# EAGLE design MT9V034 (EAGLE 9.1.2)
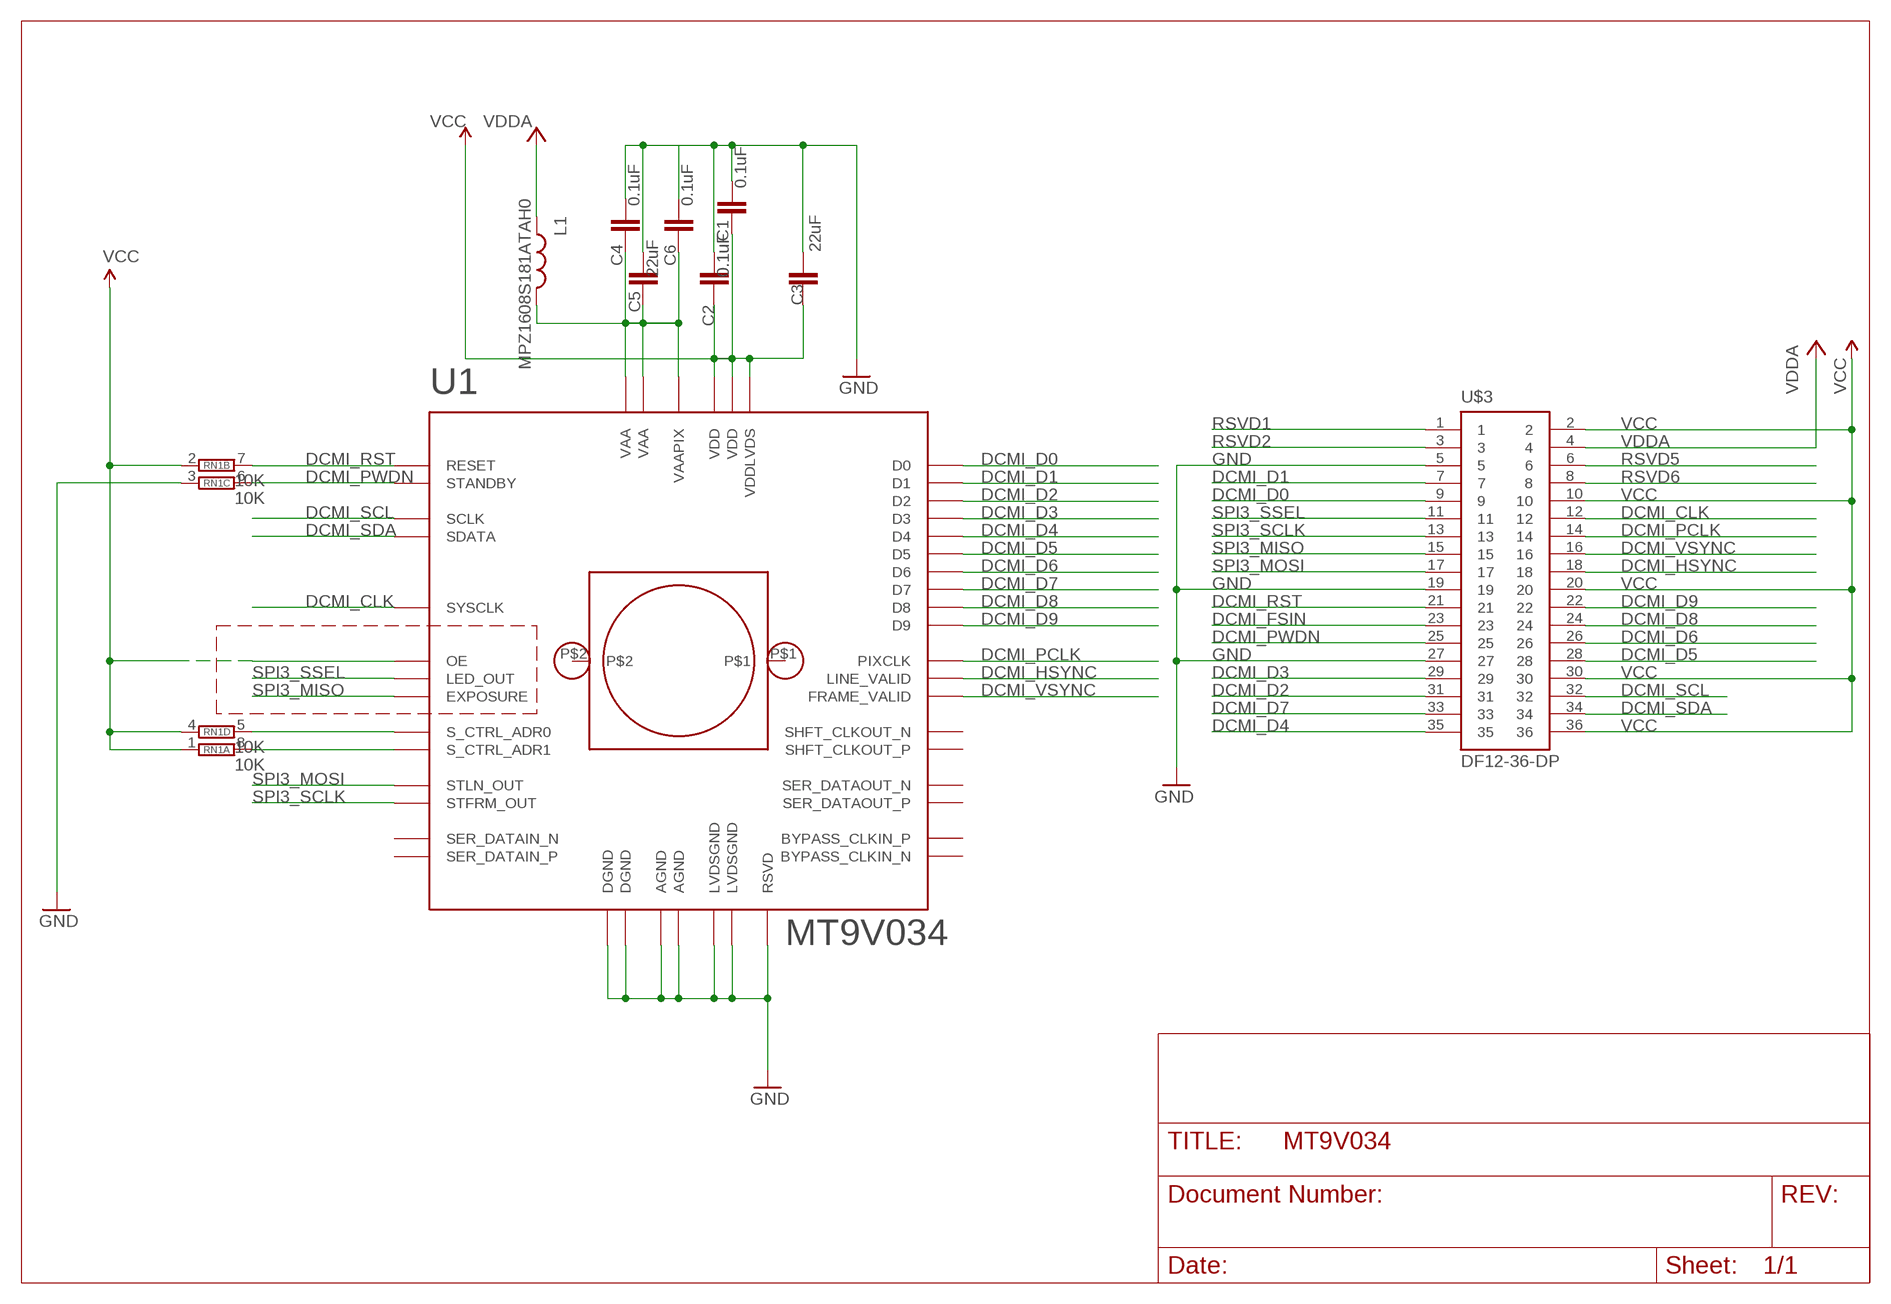
[diagram p0: schematic, sheet 1]

## Parts
C1  0.1uF  CAP0402-CAP  [0402-CAP]
C2  0.1uF  CAP0402-CAP  [0402-CAP]
C3  22uF  CAP0805  [0805]
C4  0.1uF  CAP0402-CAP  [0402-CAP]
C5  22uF  CAP0805  [0805]
C6  0.1uF  CAP0402-CAP  [0402-CAP]
L1  MPZ1608S181ATAH0  INDUCTOR0603  [0603]
LM1  LENSMOUNT20MM  [LENSMOUNT-20MM]
RN1  10K  4R-NEXBV8V  [EXBV8V]
U1  MT9V034  MT9V032  [CLCC-48]
U$3  DF12-36-DP  [DF12-36-DP]

## Nets
DCMI_CLK: U1.P$47(SYSCLK) U$3.12
DCMI_D0: U1.P$45(D0) U$3.9
DCMI_D1: U1.P$44(D1) U$3.7
DCMI_D2: U1.P$43(D2) U$3.31
DCMI_D3: U1.P$42(D3) U$3.29
DCMI_D4: U1.P$41(D4) U$3.35
DCMI_D5: U1.P$15(D5) U$3.28
DCMI_D6: U1.P$16(D6) U$3.26
DCMI_D7: U1.P$17(D7) U$3.33
DCMI_D8: U1.P$18(D8) U$3.24
DCMI_D9: U1.P$19(D9) U$3.22
DCMI_FSIN: U$3.23
DCMI_HSYNC: U1.P$20(LINE_VALID) U$3.18
DCMI_PCLK: U1.P$46(PIXCLK) U$3.14
DCMI_PWDN: RN1.6 U1.P$33(STANDBY) U$3.25
DCMI_RST: RN1.7 U1.P$32(RESET) U$3.21
DCMI_SCL: U1.P$25(SCLK) U$3.32
DCMI_SDA: U1.P$24(SDATA) U$3.34
DCMI_VSYNC: U1.P$21(FRAME_VALID) U$3.16
GND: C1.2 C2.2 C3.1 C4.2 C5.1 C6.2 RN1.3 U1.P$7(LVDSGND) U1.P$12(LVDSGND) U1.P$13(DGND) U1.P$29(RSVD) U1.P$34(AGND) U1.P$38(AGND) U1.P$48(DGND) U$3.5 U$3.19 U$3.27
N$19: RN1.5 U1.P$30(S_CTRL_ADR0)
N$20: RN1.8 U1.P$31(S_CTRL_ADR1)
RSVD1: U$3.1
RSVD2: U$3.3
RSVD5: U$3.6
RSVD6: U$3.8
SPI3_MISO: U1.P$23(EXPOSURE) U$3.15
SPI3_MOSI: U1.P$22(STLN_OUT) U$3.17
SPI3_SCLK: U1.P$26(STFRM_OUT) U$3.13
SPI3_SSEL: U1.P$27(LED_OUT) U$3.11
VAA: C4.1 C5.2 C6.1 L1.2 U1.P$35(VAA) U1.P$39(VAA) U1.P$40(VAAPIX)
VCC: C1.1 C2.1 C3.2 RN1.1 RN1.2 RN1.4 U1.P$1(VDD) U1.P$6(VDDLVDS) U1.P$14(VDD) U1.P$28(OE) U$3.2 U$3.10 U$3.20 U$3.30 U$3.36
VDDA: L1.1 U$3.4
Unconnected: LM1.P$1 LM1.P$2 U1.P$2(SHFT_CLKOUT_N) U1.P$3(SHFT_CLKOUT_P) U1.P$4(SER_DATAOUT_P) U1.P$5(SER_DATAOUT_N) U1.P$8(BYPASS_CLKIN_N) U1.P$9(BYPASS_CLKIN_P) U1.P$10(SER_DATAIN_N) U1.P$11(SER_DATAIN_P)

## Library data of the parts
C1-C6 = sfe:CAP: Capacitor Standard 0603 ceramic capacitor, and 0.1" leaded capacitor.
L1 = sfe:INDUCTOR: Inductors Basic Inductor/Choke - 0603 and 1206. Footprints are not proven and vary greatly between part numbers.
LM1 = omnivision:LENSMOUNT
RN1 = resistor-dil:4R-N: Array Chip Resistor Source: RS Component / Phycomp; OC_FARNELL: unknown; OC_NEWARK: unknown
U1 = MT9V032:MT9V032
U$3 = DF12:DF12-36-DP

## Board
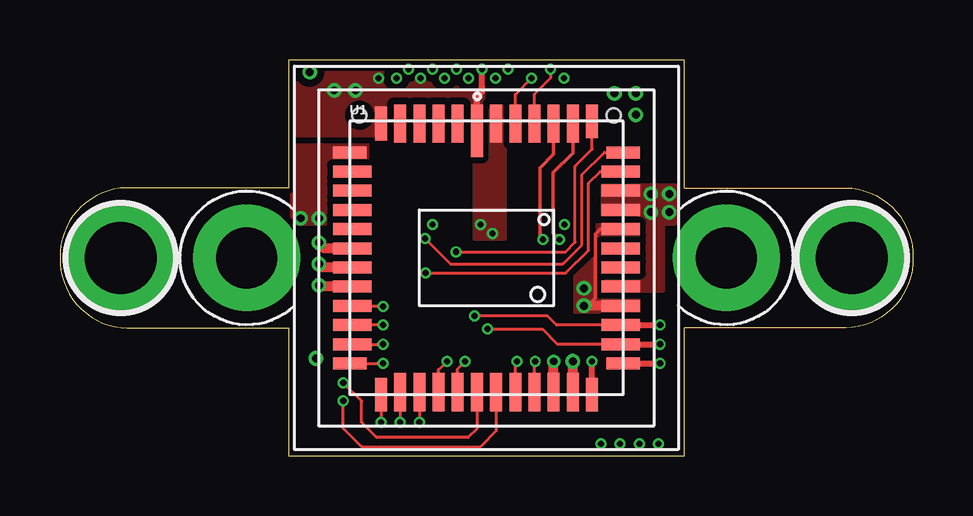
[diagram p1: board, top side]
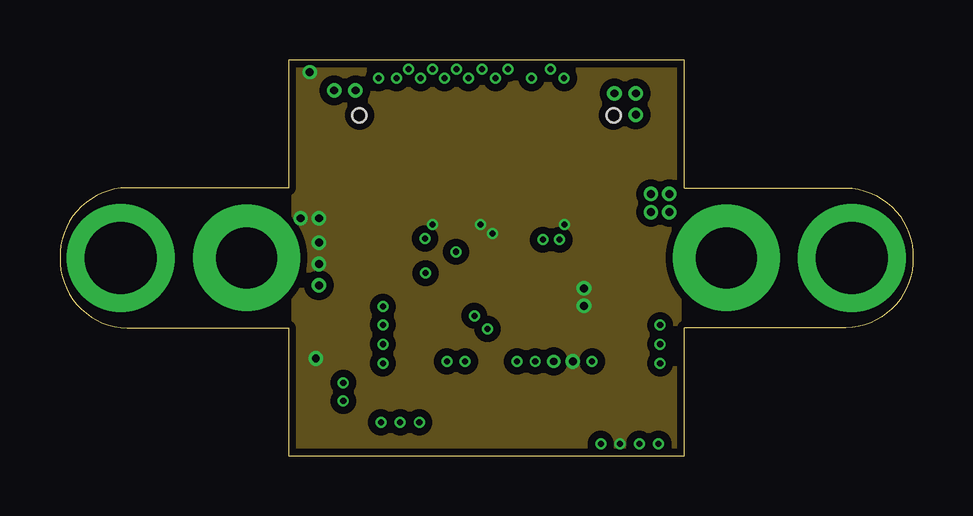
[diagram p2: board, inner layer GND]
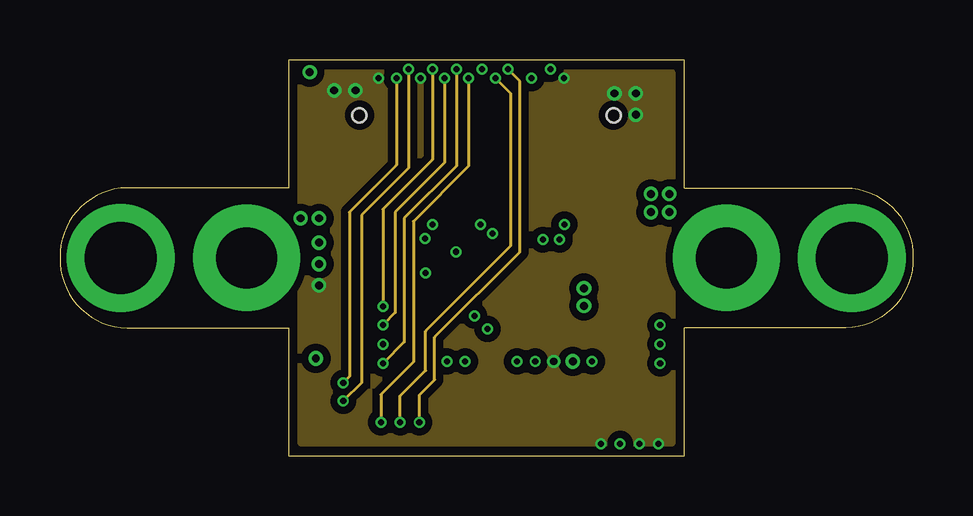
[diagram p3: board, inner layer VCC]
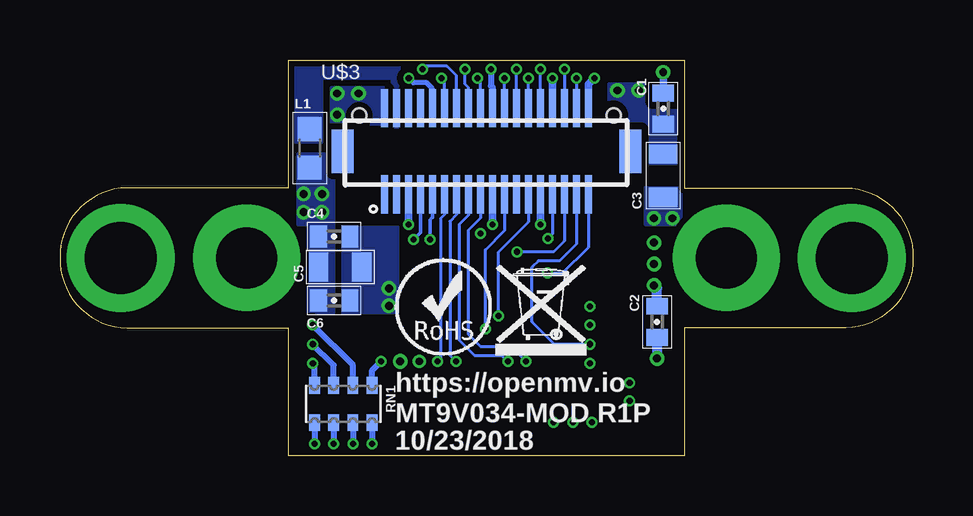
[diagram p4: board, bottom side, seen from below]

Size 35.56 x 16.51 mm. Coordinates in mm from the lower left corner, seen from the top.
Outline: 9.53,16.51 9.53,11.18 2.79,11.18 arc90 0,8.26 arc90 2.79,5.33 9.53,5.33 9.53,0 26.04,0 26.04,5.33 32.77,5.33 arc90 35.56,8.26 arc90 32.77,11.18 26.04,11.18 26.04,16.51 9.53,16.51
Copper layers (1*2+15*16): Top 0.035mm / dielectric 1.5mm / GND 0.035mm / dielectric 0.15mm / VCC 0.035mm / dielectric 0.2mm / Bottom 0.035mm
Design rules "openmv3": minimum track width 5mil, minimum drill 10mil, track to track 6mil, track to pad 6mil, pad to pad 6mil, via to via 6mil, smd to smd 6mil, copper to edge 5mil, drill to drill 10mil, minimum pad ring 10mil, minimum via ring 4mil, stop-mask expansion 2mil, vias tented up to drill 30mil, thermal gap 10mil

### Footprints (pad centres in the part's own frame; a part is rotated, then mirrored left to right if it is on the bottom)
0402-CAP = smd 0.7 x 0.9: 1 -0.65,0; 2 0.65,0
0805 = smd 0.8 x 1.2: 1 -0.9,0; 2 0.9,0
0603 = smd 1 x 1: 1 -0.8,0; 2 0.8,0
LENSMOUNT-20MM = drill 2.54 pad 4.445: P$1 -10,0; P$2 10,0
EXBV8V = smd 0.45 x 0.7: 1 -1.2,-0.775; 2 -0.4,-0.775; 3 0.4,-0.775; 4 1.2,-0.775; 5 1.2,0.775; 6 0.4,0.775; 7 -0.4,0.775; 8 -1.2,0.775
CLCC-48 = smd 0.5 x 2.2: P$1 -0.4,5.3 | smd 0.5 x 1.6: P$2 -1.2,5.6; P$3 -2,5.6; P$4 -2.8,5.6; P$5 -3.6,5.6; P$20 -3.6,-5.6; P$21 -2.8,-5.6; P$22 -2,-5.6; P$23 -1.2,-5.6; P$24 -0.4,-5.6; P$25 0.4,-5.6; P$26 1.2,-5.6; P$27 2,-5.6; P$28 2.8,-5.6; P$29 3.6,-5.6; P$44 3.6,5.6; P$45 2.8,5.6; P$46 2,5.6; P$47 1.2,5.6; P$48 0.4,5.6 | smd 0.5 x 1.4: P$6 -4.4,5.6; P$19 -4.4,-5.7; P$30 4.4,-5.7; P$43 4.4,5.7 | smd 1.4 x 0.5: P$7 -5.7,4.4; P$18 -5.7,-4.4; P$31 5.7,-4.4; P$42 5.7,4.4 | smd 1.6 x 0.5: P$8 -5.6,3.6; P$9 -5.6,2.8; P$10 -5.6,2; P$11 -5.6,1.2; P$12 -5.6,0.4; P$13 -5.6,-0.4; P$14 -5.6,-1.2; P$15 -5.6,-2; P$16 -5.6,-2.8; P$17 -5.6,-3.6; P$32 5.6,-3.6; P$33 5.6,-2.8; P$34 5.6,-2; P$35 5.6,-1.2; P$36 5.6,-0.4; P$37 5.6,0.4; P$38 5.6,1.2; P$39 5.6,2; P$40 5.6,2.8; P$41 5.6,3.6
DF12-36-DP = smd 0.3 x 1.6: 1 -4.25,-1.8; 2 -4.25,1.8; 3 -3.75,-1.8; 4 -3.75,1.8; 5 -3.25,-1.8; 6 -3.25,1.8; 7 -2.75,-1.8; 8 -2.75,1.8; 9 -2.25,-1.8; 10 -2.25,1.8; 11 -1.75,-1.8; 12 -1.75,1.8; 13 -1.25,-1.8; 14 -1.25,1.8; 15 -0.75,-1.8; 16 -0.75,1.8; 17 -0.25,-1.8; 18 -0.25,1.8; 19 0.25,-1.8; 20 0.25,1.8; 21 0.75,-1.8; 22 0.75,1.8; 23 1.25,-1.8; 24 1.25,1.8; 25 1.75,-1.8; 26 1.75,1.8; 27 2.25,-1.8; 28 2.25,1.8; 29 2.75,-1.8; 30 2.75,1.8; 31 3.25,-1.8; 32 3.25,1.8; 33 3.75,-1.8; 34 3.75,1.8; 35 4.25,-1.8; 36 4.25,1.8 | smd 0.9 x 1.8: F1 -6,0; F2 6,0 | hole 0.6: -5.3,1.5; 5.3,1.5

### Placement (x,y rotation side)
C1  10.41,14.48 90 bottom
C2  10.67,5.59 270 bottom
C3  10.41,11.68 90 bottom
C4  24.13,9.14 0 bottom
C5  23.88,7.87 180 bottom
C6  24.13,6.48 0 bottom
L1  25.15,12.83 270 bottom
LM1  17.78,8.26 0 top
RN1  23.75,2.16 0 bottom
U1  17.78,8.26 0 top
U$1  [WEEE]  17.4,4.19 0 bottom
U$2  [ROHS]  21.59,4.19 0 bottom
U$3  17.78,12.7 0 bottom

### Tracks (layer width: path | path; a pad name or v marks a point on that pad's centre or on a via)
DCMI_CLK  (via drill 0.25)
  Top 0.127: U1.P$47 18.98,15.07 v19.66,15.75
  Bottom 0.127: U$3.12 19.53,15.62 v19.66,15.75
DCMI_D0  (via drill 0.25)
  Top 0.152: U1.P$45 20.58,12.58 20,12 20,9.14 v20.13,9.02
  Bottom 0.152: U$3.9 20.03,9.94 20.07,9.91 20.13,9.84 v20.13,9.02
DCMI_D1  (via drill 0.25)
  Top 0.152: v20.83,9.02 20.56,9.28 20.56,11.81 21.38,12.63 U1.P$44
  Bottom 0.152: 20.57,10.86 U$3.7 20.53,9.31 20.57,9.27 | 20.57,9.27 | 20.57,9.27 v20.83,9.02
DCMI_D2  (via drill 0.25)
  Top 0.127: 22.18,12.78 22.18,12.83 | 22.18,12.83 U1.P$43 | 22.18,12.78 22.18,12.83 | 22.18,12.78 21.48,12.08 21.48,8.91 21.08,8.51 v16.51,8.51
  Bottom 0.127: U$3.31 14.53,8.96 14.99,8.51 v16.51,8.51
DCMI_D3  (via drill 0.25)
  Top 0.127: U1.P$42 22.69,12.65 21.75,11.72 21.75,9.02 21.75,8.79 20.96,8 16.28,8 v15.22,9.06
  Bottom 0.127: U$3.29 15.03,9.25 v15.22,9.06
DCMI_D4  (via drill 0.25)
  Top 0.127: U1.P$41 22.52,11.86 22.03,11.37 22.03,8.57 21.08,7.62 v15.24,7.62
  Bottom 0.127: U$3.35 13.53,8.7 14.61,7.62 v15.24,7.62
DCMI_D5  (via drill 0.25)
  Top 0.127: v13.46,6.22 12.21,6.22 U1.P$15
  VCC 0.127: v15.53,16.13 15.53,12.36 13.46,10.29 v13.46,6.22
  Bottom 0.127: U$3.28 v15.53,16.13
DCMI_D6  (via drill 0.25)
  Top 0.127: v13.46,5.46 U1.P$16
  VCC 0.127: v16.03,15.75 16.03,12.22 13.97,10.16 13.97,5.97 v13.46,5.46
  Bottom 0.127: U$3.26 v16.03,15.75
DCMI_D7  (via drill 0.25)
  Top 0.127: U1.P$17 v13.46,4.66
  Bottom 0.127: U$3.33 14.03,8.83 14.73,8.13 15.62,8.13 15.88,7.87 15.88,5.59 14.94,4.66 v13.46,4.66
DCMI_D8  (via drill 0.25)
  Top 0.127: U1.P$18 v13.46,3.85
  VCC 0.127: v16.53,16.13 16.53,12.09 14.35,9.91 14.35,4.74 v13.46,3.85
  Bottom 0.127: U$3.24 v16.53,16.13
DCMI_D9  (via drill 0.25)
  Top 0.127: U1.P$19 v13.38,1.4
  VCC 0.127: v17.03,15.75 17.03,12.08 14.73,9.78 14.73,3.91 U1.P$19 v13.38,1.4
  Bottom 0.127: U$3.22 v17.03,15.75
DCMI_HSYNC  (via drill 0.25)
  Top 0.127: U1.P$20 v14.18,1.4
  VCC 0.127: v14.18,1.4 14.18,2.5 15.24,3.56 15.24,5.21 18.8,8.76 18.8,15.11 v18.16,15.75
  Bottom 0.127: U$3.18 18.03,15.62 v18.16,15.75
DCMI_PCLK  (via drill 0.25)
  Top 0.127: U1.P$46 19.78,15.08 20.45,15.75 v20.45,16.13
  Bottom 0.127: U$3.14 19.03,15.86 19.43,16.26 20.32,16.26 v20.45,16.13
DCMI_PWDN  (via drill 0.25)
  Top 0.127: U1.P$33 20.71,5.46 20.32,5.84 v17.28,5.84
  Top 0.254: U1.P$33 v25.02,5.46
  Bottom 0.127: U$3.25 16.03,9.75 17.28,8.5 v17.28,5.84
  Bottom 0.254: RN1.6 23.35,3.79 v25.02,5.46
DCMI_RST  (via drill 0.25)
  Top 0.127: v17.82,5.29 20.11,5.29 20.75,4.66 U1.P$32
  Top 0.254: U1.P$32 v25.02,4.66
  Bottom 0.127: U$3.21 17.03,9.39 17.82,8.59 v17.82,5.29
  Bottom 0.254: RN1.7 24.15,3.79 v25.02,4.66
DCMI_SCL  (via drill 0.25)
  Top 0.127: U1.P$25 18.18,1.03 17.53,0.38 12.57,0.38 11.81,1.14 v11.81,2.29
  VCC 0.127: v14.53,16.13 14.53,11.99 12.57,10.03 12.57,3.05 v11.81,2.29
  Bottom 0.127: v14.53,16.13 U$3.32
DCMI_SDA  (via drill 0.25)
  Top 0.127: U1.P$24 17.38,1.12 17.02,0.76 13.21,0.76 12.57,1.4 12.57,2.29 v11.81,3.05
  VCC 0.127: v14.03,15.75 14.03,12.12 12.07,10.16 12.07,3.3 v11.81,3.05
  Bottom 0.127: v14.03,15.75 U$3.34
DCMI_VSYNC  (via drill 0.25)
  Top 0.127: U1.P$21 v14.98,1.4
  VCC 0.127: v14.98,1.4 14.98,2.53 15.62,3.17 15.62,4.95 19.18,8.51 19.18,15.62 v18.67,16.13
  Bottom 0.127: U$3.16 18.53,15.36 18.67,15.49 v18.67,16.13
GND  (via drill 0.25, 0.33, 0.33 pad 0.61)
  Top 0.152: U1.P$38 22.54,9.46 22.33,9.24 22.33,6.58 22.23,6.48
  Top 0.406: U1.P$12 11.03,8.65 v10.79,8.89 | U1.P$13 10.94,7.86 v10.79,8 | U1.P$29 v21.38,3.94 | U1.P$34 v21.84,6.25
  Bottom 0.254: RN1.3 v23.35,0.51
  Bottom 0.305: C1.2 v10.41,16 | U$3.27 v15.53,9.65 | U$3.5 v21.03,9.65 | U$3.19 v17.53,9.65
  Bottom 0.406: C2.2 v10.67,4.06
  other vias: 10.79,9.91 10.03,9.91 21.84,6.99 18.03,9.27
  pour Top (isolate 0.254, rank 5, no thermals): 9.65,13.08 12.83,13.08 12.83,9.65 9.65,9.65
  pour GND (isolate 0.305): 9.78,0.25 9.78,16.26 25.78,16.26 25.78,0.25
  pour Bottom (isolate 0.254, rank 5, no thermals): 21.46,9.53 23.88,9.53 23.88,5.97 21.46,5.97
  pour Top (isolate 0.254, rank 5, no thermals): 21.46,9.65 24.13,9.65 24.13,5.97 21.46,5.97
  pour Bottom (isolate 0.254, rank 5, no thermals): 9.65,11.18 11.18,11.18 11.18,9.65 9.65,9.65
  pour Top (isolate 0.254, rank 5, no thermals): 17.27,14.61 18.54,14.61 18.54,9.02 17.27,9.02
N$3  (via drill 3 pad 4.5)
  other vias: 2.54,8.26
N$4  (via drill 3 pad 4.5)
  other vias: 33.02,8.26
N$19  (via drill 0.25)
  Top 0.254: U1.P$30 v22.18,3.94
  Bottom 0.254: RN1.5 22.55,3.57 v22.18,3.94
N$20  (via drill 0.25)
  Top 0.254: U1.P$31 v25.02,3.85
  Bottom 0.254: RN1.8 24.95,3.79 v25.02,3.85
SPI3_MISO  (via drill 0.25)
  Top 0.127: U1.P$23 16.58,3.63 v16.89,3.94
  Bottom 0.127: v16.89,3.94 17.14,4.19 18.29,4.19 18.92,4.83 18.92,9.65 18.53,10.04 U$3.15
SPI3_MOSI  (via drill 0.25)
  Top 0.127: U1.P$22 15.78,3.59 v16.13,3.94
  Bottom 0.127: U$3.17 18.03,9.91 18.54,9.4 18.54,5.08 18.03,4.57 16.76,4.57 v16.13,3.94
SPI3_SCLK  (via drill 0.25)
  Top 0.127: U1.P$26 18.98,3.87 v19.05,3.94
  Bottom 0.127: U$3.13 19.03,10.05 19.3,9.78 19.3,4.19 v19.05,3.94
SPI3_SSEL  (via drill 0.25)
  Top 0.127: U1.P$27 19.78,3.9 v19.81,3.94
  Bottom 0.127: U$3.11 19.53,10.06 19.69,9.91 19.69,4.06 v19.81,3.94
VAA  (via drill 0.33)
  other vias: 24.64,10.92 25.4,10.92 24.64,10.16 25.4,10.16
  pour Bottom (isolate 0.254, no thermals): 24.13,5.97 24.13,12.57 25.65,12.57 25.65,9.65 25.15,9.65 25.15,5.97
  pour Top (isolate 0.254, no thermals): 22.61,6.86 22.61,7.37 24.13,7.37 24.13,10.03 22.61,10.03 22.61,11.3 25.65,11.3 25.65,9.65 25.15,9.65 25.15,6.86
VCC  (via drill 0.25, 0.3, 0.33 pad 0.61)
  Top 0.254: U1.P$1 17.38,14.97 17.59,15.18 v17.59,16.13
  Top 0.406: U1.P$14 10.85,7.05 v10.79,7.11 | U1.P$28 v20.58,3.94
  Bottom 0.203: v21.02,15.75 20.83,15.55 20.27,15.55 20.03,15.31 U$3.10
  Bottom 0.254: RN1.1 v24.95,0.51 | RN1.2 v24.15,0.51 | RN1.4 v22.55,0.51 | U$3.20 17.53,15.37 17.59,15.43 v17.59,16.13
  Bottom 0.305: U$3.30 v15.03,15.75 | U$3.36 13.53,15.49 v13.28,15.75
  Bottom 0.406: C2.1 10.67,6.99 v10.79,7.11
  other vias: 24,15.11 24,14.22 23.11,15.11 11.43,15.24 12.32,15.24
  pour Bottom (isolate 0.254, rank 6, no thermals): 21.84,13.84 21.84,15.37 24.26,15.37 24.26,13.84
  pour Top (isolate 0.305, rank 2, no thermals): 9.65,16 17.65,16 17.65,13.34 9.65,13.34
  pour Bottom (isolate 0.305, rank 2, no thermals): 9.65,15.49 12.7,15.49 12.7,12.19 9.65,12.19
  pour VCC (isolate 0.305): 10.03,0.51 10.03,16 25.53,16 25.53,0.51
VDDA
  pour Bottom (isolate 0.254, rank 3, no thermals): 21.4,13.72 21.4,16.51 25.78,16.51 25.78,13.08 24.64,13.08 24.64,15.75 21.72,15.75 21.72,13.72

### Text on the board
bPlace: https://openmv.io | MT9V034-MOD R1P | 10/23/2018